# Altium schematic sheet Connectors.SchDoc
size A3; SheetNumber: 3; SheetTotal: 9
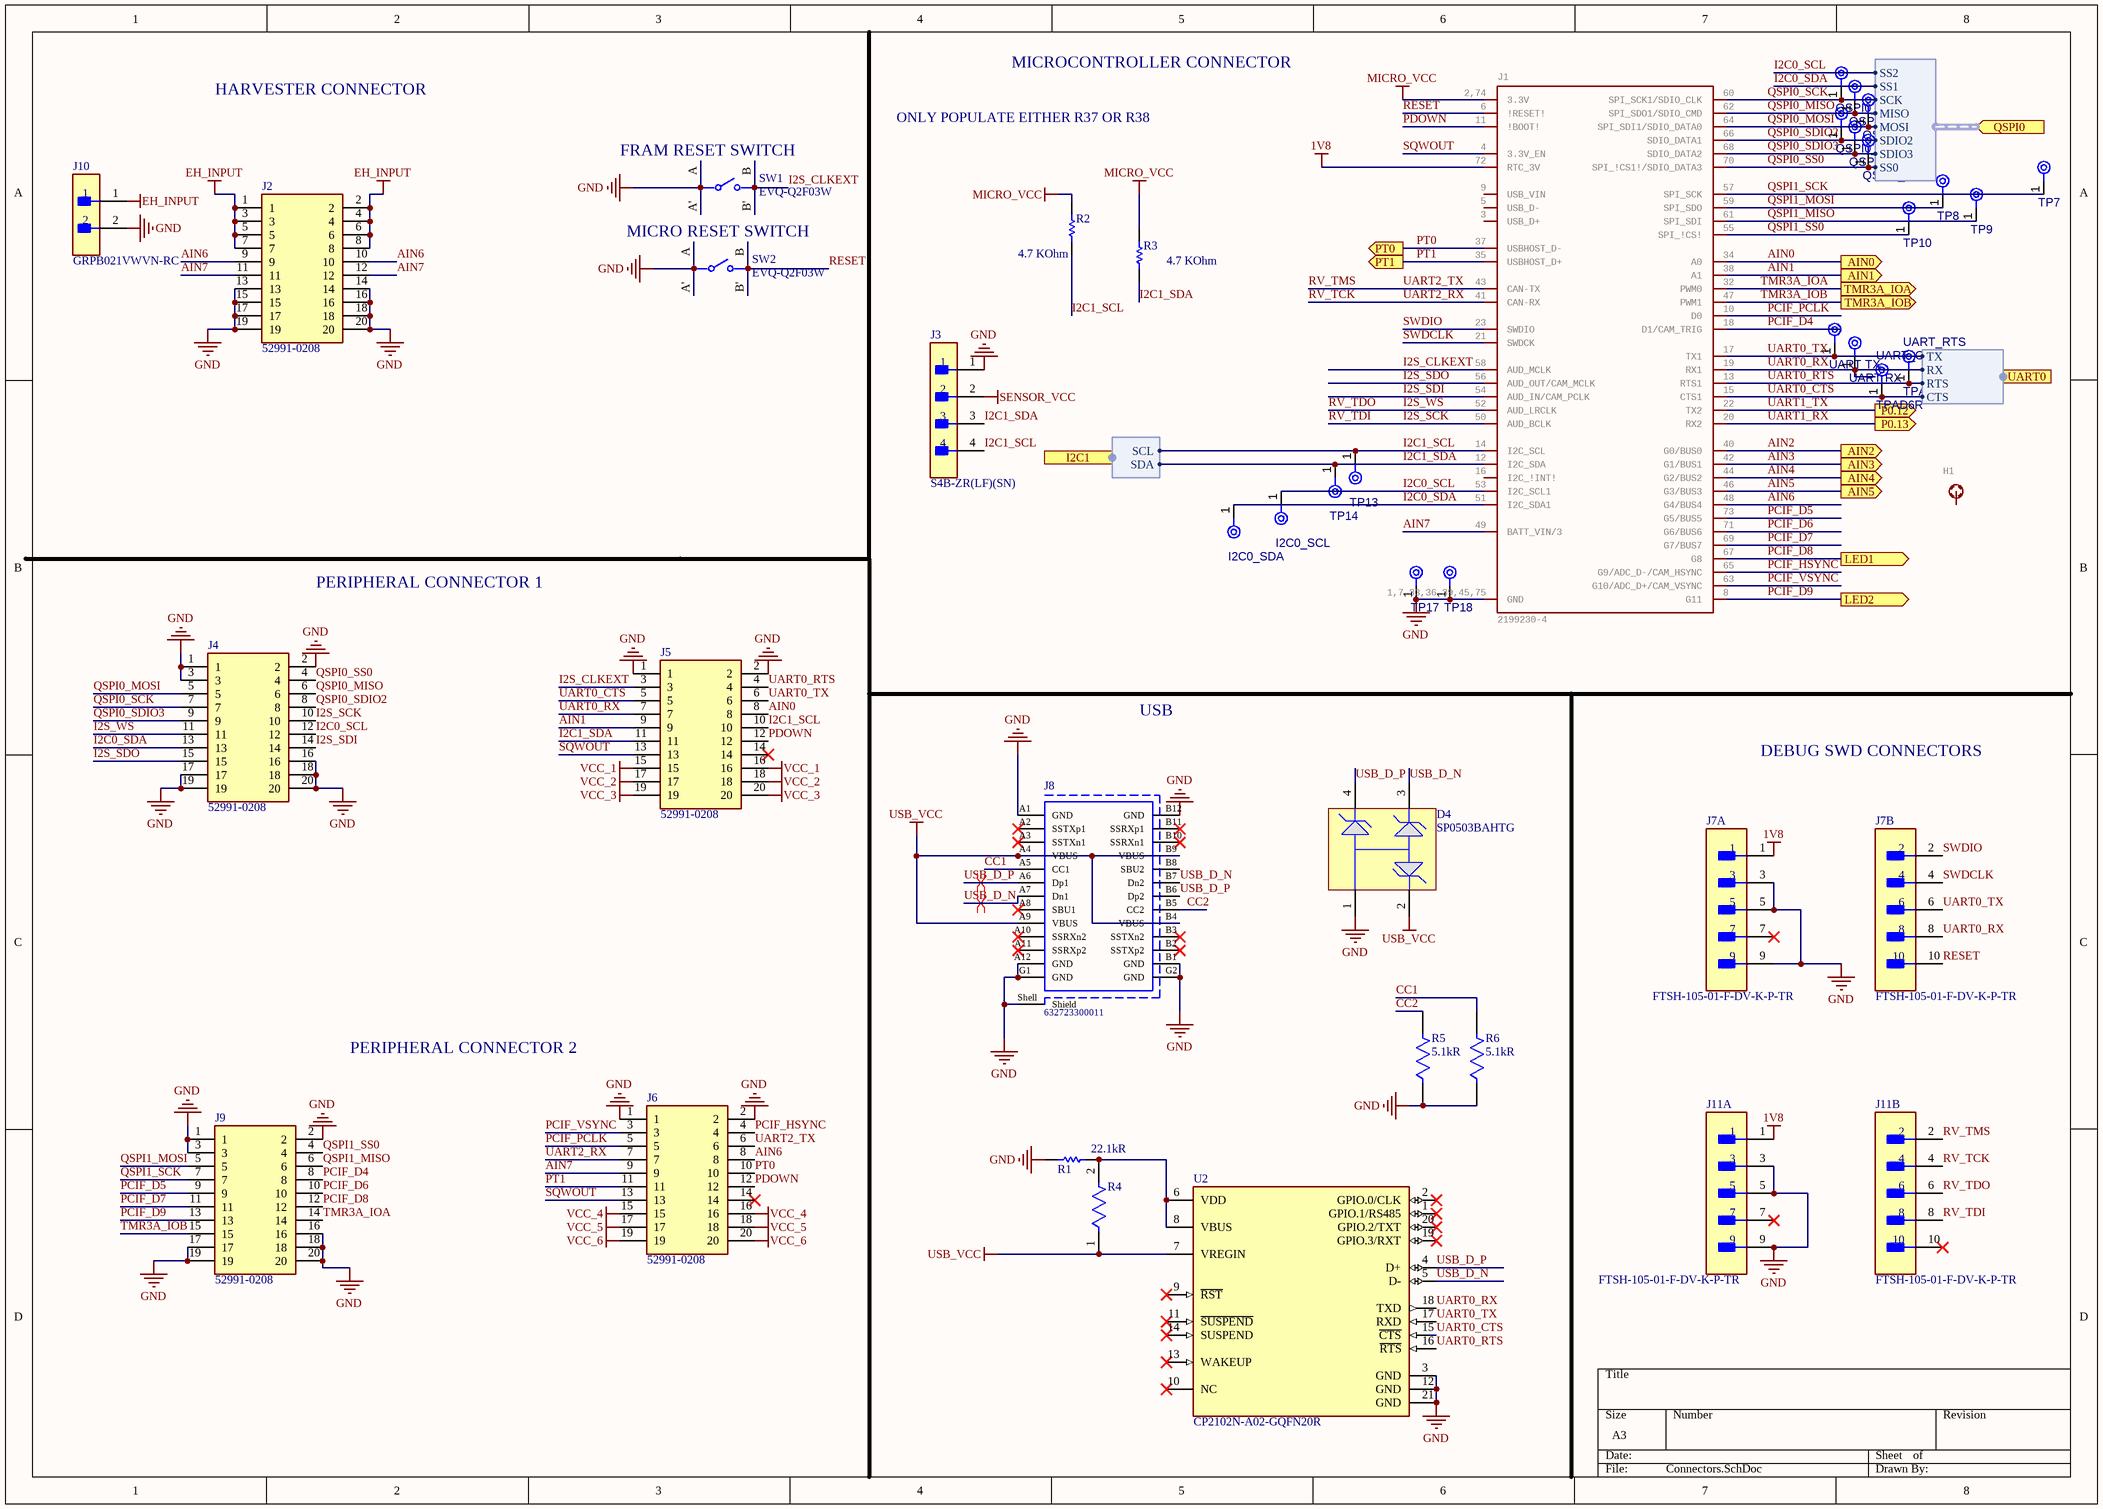
[diagram p0: Connectors.SchDoc]

## Parts
D4  SP0503BAHTG  [LFUS-SOT143-4_V]
H1  9774025151R  [STAND-OFF-REFLOW-M2-5]  (value not drawn)
I2C0_SCL  TPAD6R  [TP06R]  (value not drawn)  (no BOM)
I2C0_SDA  TPAD6R  [TP06R]  (value not drawn)  (no BOM)
J1  2199230-4  [M-2-CONNECTOR-E]
J2  52991-0208  [MOLEX_52991-0208]
J3  S4B-ZR(LF)(SN)  [FP-S4B-ZR_LF_SN-MFG]
J4  52991-0208  [MOLEX_52991-0208]
J5  52991-0208  [MOLEX_52991-0208]
J6  52991-0208  [MOLEX_52991-0208]
J7  FTSH-105-01-F-DV-K-P-TR  [FP-FTSH-105-01-F-DV-K-P-T-MFG]  (parts A,B of 2)
J8  632723300011  [632723300011]
J9  52991-0208  [MOLEX_52991-0208]
J10  GRPB021VWVN-RC  [FP-GRPB021VWVN-RC-MFG]
J11  FTSH-105-01-F-DV-K-P-TR  [FP-FTSH-105-01-F-DV-K-P-T-MFG]  (parts A,B of 2)
QSPI0_MISO  TPAD6R  [TP06R]  (value not drawn)  (no BOM)
QSPI0_MOSI  TPAD6R  [TP06R]  (value not drawn)  (no BOM)
QSPI0_SCK  TPAD6R  [TP06R]  (value not drawn)  (no BOM)
QSPI0_SDIO2  TPAD6R  [TP06R]  (value not drawn)  (no BOM)
QSPI0_SDIO3  TPAD6R  [TP06R]  (value not drawn)  (no BOM)
QSPI0_SS0  TPAD6R  [TP06R]  (value not drawn)  (no BOM)
R1  CRCW040247K5FKED  [RESC1005X40X25ML05T05]  (value not drawn)
R2  Resistance: 4.7 KOhm  [RESC1005X40X25ML05T05]  (hidden comment: RMCF0402JT4K70)
R3  Resistance: 4.7 KOhm  [RESC1005X40X25ML05T05]  (hidden comment: RMCF0402JT4K70)
R4  Resistance: 22.1kR  [FP-ERJ2RK-IPC_C]  (hidden comment: ERJ-2RKF2212X)
R5  Resistance: 5.1kR  [FP-CRCW0402-e3-IPC_A]  (hidden comment: CRCW04025K10FKED)
R6  Resistance: 5.1kR  [FP-CRCW0402-e3-IPC_A]  (hidden comment: CRCW04025K10FKED)
SW1  EVQ-Q2F03W  [FP-EVQ-Q2F03W-MFG]
SW2  EVQ-Q2F03W  [FP-EVQ-Q2F03W-MFG]
TP7  TPAD6R  [TP06R]  (value not drawn)  (no BOM)
TP8  TPAD6R  [TP06R]  (value not drawn)  (no BOM)
TP9  TPAD6R  [TP06R]  (value not drawn)  (no BOM)
TP10  TPAD6R  [TP06R]  (value not drawn)  (no BOM)
TP13  TPAD6R  [TP06R]  (value not drawn)  (no BOM)
TP14  TPAD6R  [TP06R]  (value not drawn)  (no BOM)
TP17  TPAD6R  [TP06R]  (value not drawn)  (no BOM)
TP18  TPAD6R  [TP06R]  (value not drawn)  (no BOM)
U2  CP2102N-A02-GQFN20R  [FP-CP2102N-A02-GQFN20R-MFG]
UART_CTS  TPAD6R  [TP06R]  (no BOM)
UART_RTS  TPAD6R  [TP06R]  (no BOM)
UART_RX  TPAD6R  [TP06R]  (value not drawn)  (no BOM)
UART_TX  TPAD6R  [TP06R]  (value not drawn)  (no BOM)

## Ports
AIN0 (out), AIN1 (out), AIN2 (out), AIN3 (out), AIN4 (out), AIN5 (out), I2C1 (in, harness I2C1), LED1 (out), LED2 (out), P0.12 (out), P0.13 (out), PT0 (out), PT1 (out), QSPI0 (in, harness QSPI0), TMR3A_IOA (out), TMR3A_IOB (out), UART0 (out, harness *)

## Harnesses
QSPI0: SCK, MISO, MOSI, SDIO2, SDIO3, SS0, SS1, SS2
I2C1: SCL, SDA
*: TX, RX, RTS, CTS

## Nets
1V8: J1.72(RTC_3V) J7.1 J11.1
EH_INPUT: J2.1 J2.2 J2.3 J2.4 J2.5 J2.6 J2.7 J2.8 J10.1
GND: D4.1 J1.1,7,33,36,39,45,75(GND) J2.13 J2.14 J2.15 J2.16 J2.17 J2.18 J2.19 J2.20 J3.1 J4.1 J4.2 J4.3 J4.16 J4.17 J4.18 J4.19 J4.20 J5.1 J5.2 J6.1 J6.2 J7.3 J7.5 J7.9 J8.A1(GND) J8.A12(GND) J8.B1(GND) J8.B12(GND) J8.G1(GND) J8.G2(GND) J8.Shell(Shield) J9.1 J9.2 J9.3 J9.16 J9.17 J9.18 J9.19 J9.20 J10.2 J11.3 J11.5 J11.9 R1.1 R5.1 R6.1 SW1.A SW1.A' SW2.A SW2.A' TP17.1(TP) TP18.1(TP) U2.3(GND) U2.12(GND) U2.21(GND)
MICRO_VCC: J1.2,74(3.3V) R2.2 R3.2
SENSOR_VCC: J3.2
USB_VCC: D4.2 J8.A4(VBUS) J8.A9(VBUS) J8.B4(VBUS) J8.B9(VBUS) R4.1 U2.7(VREGIN)
VCC_1: J5.15 J5.16
VCC_2: J5.17 J5.18
VCC_3: J5.19 J5.20
VCC_4: J6.15 J6.16
VCC_5: J6.17 J6.18
VCC_6: J6.19 J6.20
AIN0: J1.34(A0) J5.8 ; port AIN0
AIN1: J1.38(A1) J5.9 ; port AIN1
AIN2: J1.40(G0/BUS0) ; port AIN2
AIN3: J1.42(G1/BUS1) ; port AIN3
AIN4: J1.44(G2/BUS2) ; port AIN4
AIN5: J1.46(G3/BUS3) ; port AIN5
AIN6: J1.48(G4/BUS4) J2.9 J2.10 J6.8
AIN7: J1.49(BATT_VIN/3) J2.11 J2.12 J6.9
CC1: J8.A5(CC1) R6.2
CC2: J8.B5(CC2) R5.2
I2C0_SCL: I2C0_SCL.1(TP) J1.53(I2C_SCL1) J4.12 ; port QSPI0.SS2
I2C0_SDA: I2C0_SDA.1(TP) J1.51(I2C_SDA1) J4.13 ; port QSPI0.SS1
I2C1_SCL: J1.14(I2C_SCL) J3.4 J5.10 R2.1 TP13.1(TP) ; port I2C1.SCL
I2C1_SDA: J1.12(I2C_SDA) J3.3 J5.11 R3.1 TP14.1(TP) ; port I2C1.SDA
I2S_CLKEXT: J1.58(AUD_MCLK) J5.3 SW1.B SW1.B'
I2S_SCK: J1.50(AUD_BCLK) J4.10 J11.8  [also labelled RV_TDI]
I2S_SDI: J1.54(AUD_IN/CAM_PCLK) J4.14
I2S_SDO: J1.56(AUD_OUT/CAM_MCLK) J4.15
I2S_WS: J1.52(AUD_LRCLK) J4.11 J11.6  [also labelled RV_TDO]
PCIF_D4: J1.18(D1/CAM_TRIG) J9.8
PCIF_D5: J1.73(G5/BUS5) J9.9
PCIF_D6: J1.71(G6/BUS6) J9.10
PCIF_D7: J1.69(G7/BUS7) J9.11
PCIF_D8: J1.67(G8) J9.12 ; port LED1
PCIF_D9: J1.8(G11) J9.13 ; port LED2
PCIF_HSYNC: J1.65(G9/ADC_D-/CAM_HSYNC) J6.4
PCIF_PCLK: J1.10(D0) J6.5
PCIF_VSYNC: J1.63(G10/ADC_D+/CAM_VSYNC) J6.3
PDOWN: J1.11(!BOOT!) J5.12 J6.12
PT0: J1.37(USBHOST_D-) J6.10 ; port PT0
PT1: J1.35(USBHOST_D+) J6.11 ; port PT1
QSPI0_MISO: J1.62(SPI_SDO1/SDIO_CMD) J4.6 QSPI0_MISO.1(TP) ; port QSPI0.MISO
QSPI0_MOSI: J1.64(SPI_SDI1/SDIO_DATA0) J4.5 QSPI0_MOSI.1(TP) ; port QSPI0.MOSI
QSPI0_SCK: J1.60(SPI_SCK1/SDIO_CLK) J4.7 QSPI0_SCK.1(TP) ; port QSPI0.SCK
QSPI0_SDIO2: J1.66(SDIO_DATA1) J4.8 QSPI0_SDIO2.1(TP) ; port QSPI0.SDIO2
QSPI0_SDIO3: J1.68(SDIO_DATA2) J4.9 QSPI0_SDIO3.1(TP) ; port QSPI0.SDIO3
QSPI0_SS0: J1.70(SPI_!CS1!/SDIO_DATA3) J4.4 QSPI0_SS0.1(TP) ; port QSPI0.SS0
QSPI1_MISO: J1.61(SPI_SDI) J9.6 TP9.1(TP)
QSPI1_MOSI: J1.59(SPI_SDO) J9.5 TP8.1(TP)
QSPI1_SCK: J1.57(SPI_SCK) J9.7 TP7.1(TP)
QSPI1_SS0: J1.55(SPI_!CS!) J9.4 TP10.1(TP)
RESET: J1.6(!RESET!) J7.10 SW2.B SW2.B'
RV_TCK: J1.41(CAN-RX) J6.7 J11.4  [also labelled UART2_RX]
RV_TMS: J1.43(CAN-TX) J6.6 J11.2  [also labelled UART2_TX]
SQWOUT: J1.4(3.3V_EN) J5.13 J6.13
SWDCLK: J1.21(SWDCK) J7.4
SWDIO: J1.23(SWDIO) J7.2
TMR3A_IOA: J1.32(PWM0) J9.14 ; port TMR3A_IOA
TMR3A_IOB: J1.47(PWM1) J9.15 ; port TMR3A_IOB
UART0_CTS: J1.15(CTS1) J5.5 U2.15(~{CTS}) UART_CTS.1(TP) ; port UART0.CTS
UART0_RTS: J1.13(RTS1) J5.4 U2.16(~{RTS}) UART_RTS.1(TP) ; port UART0.RTS
UART0_RX: J1.19(RX1) J5.7 J7.8 U2.18(TXD) UART_RX.1(TP) ; port UART0.RX
UART0_TX: J1.17(TX1) J5.6 J7.6 U2.17(RXD) UART_TX.1(TP) ; port UART0.TX
UART1_RX: J1.20(RX2) ; port P0.13
UART1_TX: J1.22(TX2) ; port P0.12
USB_D_N: D4.3 J8.A7(Dn1) J8.B7(Dn2) U2.5(D-)
USB_D_P: D4.4 J8.A6(Dp1) J8.B6(Dp2) U2.4(D+)
NetR1_2: R1.2 R4.2 U2.6(VDD) U2.8(VBUS)

Not connected (* = marked no-connect by the designer): H1 1; J1 3(USB_D+) 5(USB_D-) 9(USB_VIN) 16(I2C_!INT!); J5 14*; J6 14*; J7 7*; J8 A2(SSTXp1)* A3(SSTXn1)* A8(SBU1)* A10(SSRXn2)* A11(SSRXp2)* B2(SSTXp2)* B3(SSTXn2)* B8(SBU2) B10(SSRXn1)* B11(SSRXp1)*; J11 7* 10*; U2 1(GPIO.1/RS485)* 2(GPIO.0/CLK)* 9(~{RST})* 10(NC)* 11(~{SUSPEND})* 13(WAKEUP)* 14(SUSPEND)* 19(GPIO.3/RXT)* 20(GPIO.2/TXT)*

## Layout directives
differential pair: USB_D_N, USB_D_P

## Notes on the sheet
- HARVESTER CONNECTOR
- MICROCONTROLLER CONNECTOR
- (near SW1) FRAM RESET SWITCH
- ONLY POPULATE EITHER R37 OR R38
- MICRO RESET SWITCH
- PERIPHERAL CONNECTOR 1
- USB
- DEBUG SWD CONNECTORS
- PERIPHERAL CONNECTOR 2

## Library data of the parts
D4 = CMP-2000-05191-1: TVS Diode Array, 30 pF, 30 KV, -40 to 85 degC, 4-Pin SOT143, RoHS, Tape and Reel; Manufacturer: Littelfuse; Direction Type: Uni-Directional; Product Height (mm): 1.05mm; Leakage Current (Max): 0.1uA; Clamping Voltage (Max): 8V; Reverse Stand-off Voltage: 5.5(Min)V; Configuration: Triple; Working Voltage: 5.5V; Product Length (mm): 3.04mm; Working Voltage (Max): 5.5V(Min); Capacitance Value: 30pF; Rad Hardened: No; Number of Elements: 3; Product Depth (mm): 1.4mm; Operating Temperature Max Deg. C: 85C; Suppressor Type: TVS; Operating Temperature Min Deg. C: -40C; Operating Temp Range: -40Cto85C; Mounting: SurfaceMount; Package / Case: SOT-143; Datasheet Version: Dec-13; Package Type: SOT-143; Packaging: TapeandReel; Pin Count: 3+Tab; Operating Temperature Classification: Industrial; Datasheet URL: https://datasheet.ciiva.com/15143/getdatasheetpartid-116020-15143550.pdf; Manufacturer URL: http://www.littelfuse.com/; Leakage Current: 0.1uA; Mounting Style: SurfaceMount; Clamping Voltage: 8V; Polarity: Uni-Directional
H1 = STAND-OFF-REFLOW2.5MM_TALL: GateName_1: G$1; PROD_ID: HW-14899; SymbolName_1: STAND-OFF-REFLOW; DeviceName: 2.5MM_TALL; LibraryName: SparkFun-Hardware; DeviceSetName: STAND-OFF-REFLOW; Package: STAND-OFF-REFLOW-M2.5
I2C0_SCL I2C0_SDA QSPI0_MISO QSPI0_MOSI QSPI0_SCK QSPI0_SDIO2 QSPI0_SDIO3 QSPI0_SS0 TP7-TP10 TP13 TP14 TP17 TP18 UART_CTS UART_RTS UART_RX UART_TX = CMP-00028-00002-2: 0.6mm round; Pins: 1
J1 = MICROMOD-2222-C: GateName_1: J1; PROD_ID: CONN-14877; SymbolName_1: MICROMOD; DeviceName: -2222-C; LibraryName: SparkFun-MicroMod; DeviceSetName: MICROMOD; Package: M.2-CONNECTOR-E
J2 J4-J6 J9 = 52991-0208: 20 Position Connector Receptacle, Center Strip Contacts Surface Mount Gold; MF: Molex; SnapEDA_Link: https://www.snapeda.com/parts/52991-0208/Molex/view-part/230631/?ref=snap; Availability: Unavailable; MP: 52991-0208; Price: None; Package: None; Value: *
J3 = CMP-17439-000004-1: CONN HEADER R/A 4POS 1.5MM; Manufacturer: JST; Conn Gender: Male; Conn Orientation: Right Angle; Number Of Contacts: 4; Voltage Rating: 50V; Current Rating: 1A; Device Class L3: unset; Number Of Rows: 1; Category: Conn; ComponentLink2URL: http://www.jst-mfg.com/product/pdf/eng/eZH.pdf; Height: 3.7mm; Pitch: 1.5mm; Device Class L1: Connectors; Octopart: https://octopart.com/s4b-zr%28lf%29%28sn%29-jst-248835; Package: S4B-ZR(LF)(SN); Temperature: -25°C to +85°C; Digikey Description: CONN HEADER R/A 4POS 1.5MM; Contact Material: Tin; Manufacturer Part Number: S4B-ZR(LF)(SN); Temperature Range High: +85°C; Automotive: No; Temperature Range Low: -25°C; Lead Free: Yes; RoHS: TRUE; ComponentLink2Description: Datasheet; Device Class L2: Headers and Wire Housings
J7 J11 = CMP-02766-000120-1: CONN HEADER SMD 10POS 1.27MM; Number of Contacts: 10; Row Spacing: 0.05inch; Connector Type: Male Pin; Contact Plating: Gold; Housing Material: Polymer; Length: 6.35mm; Number of Rows: 2; Min Operating Temperature: -55°C; Pitch: 1.27mm; Termination: Solder; Package Quantity: 500; Lead Free: Lead Free; Radiation Hardening: No; Number of Positions: 10; Orientation: Straight; Contact Material: Bronze; Packaging: Tape and Reel; Depth: 5.84mm; Contact Mating Length: 0.12inch; Housing Color: Black; Mount: Surface Mount; Color: Black; Max Operating Temperature: 125°C
J8 = CMP-1502-03214-1: USB 3.1 Type C Receptacle WR-COM, Horizontal, SMT / THT; Manufacturer: Wurth Elektronik; Rated Current: 5A; Contact Resistance: 30mOhm; Working Voltage: 20VDC; Operating Temperature: -40to105degC; Package Reference: 632723300011; Datasheet URL: https://katalog.we-online.de/em/datasheet/632723x00011%282%29.pdf; Manufacturer URL: http://www.we-online.de; Connector Type: USB3.1TypeC; Gender: Receptacle; Part Number: 632723300011; Mounting Technology: SMT/THT; Publisher: WurthElektronik; Packaging: TapeandReel; Orientation: Horizontal
J10 = CMP-2000-06371-2: CONN HEADER VERT 2POS 1.27MM; Number of Positions: 2; Connector Type: Male Pin; Pitch: 0.05inch; Contact Plating: Gold; Lead Free: Lead Free; Termination: Solder; Packaging: Bulk; RoHS Compliant: Yes; Contact Type: Male Pin; Mount: Through Hole; Number of Rows: 1; Contact Mating Length: 0.118inch; Package Quantity: 1
R1 = CMP-2002-00027-1: Manufacturer: Vishay Dale; Part Number: CRCW040247K5FKED
R2 R3 = CMP-2002-01154-4: Chip Resistor, 4.7 KOhm, +/- 1%, 0.1 W, -55 to 155 degC, 0402 (1005 Metric), RoHS, Tape and Reel; PartNumber: ERJ-2RKF4701X; Voltage Rating: 50 V; Case\/Package: 0402; Power Rating: 100 mW; Height: 0.35 mm; Mounting Technology: Surface Mount; REACH SVHC: Yes; Max Operating Temperature: 155 degC; ComponentLink1Description: Manufacturer URL; ComponentLink2Description: Datasheet; Pins: 2; PackageReference: 0402; Tolerance: 1%; Case Code (Imperial): 0402; Length: 1 mm; PackageDescription: 2-Pin Surface Mount Device, Body 1 x 0.5 mm; RoHSCompliant: true; Package Quantity: 1; Radiation Hardening: No; DatasheetVersion: 04/2015; Width: 0.5 mm; Case Code (Metric): 1005; Mount: Surface Mount; ComponentLink1URL: http://www.panasonic.com/; Min Operating Temperature: -55 degC; Packaging: Cut Tape; ComponentLink2URL: http://industrial.panasonic.com/cdbs/www-data/pdf/RDA0000/AOA0000C86.pdf
R4 = CMP-1011-00660-3: RES SMD 22.1K OHM 1% 1/10W 0402; Max Power Dissipation: 100mW; Temperature Coefficient: 100ppm/°C; Voltage Rating (DC): 50V; Features: Automotive AEC-Q200; Case Code (Imperial): 0402; Mount: Surface Mount; Min Operating Temperature: -55°C; Package Quantity: 1; Radiation Hardening: No; Case/Package: 0402; Max Operating Temperature: 155°C; Tolerance: 1%; Series: ERJ; Size Code: 0402; RoHS Compliant: Yes; Packaging: Tape and Reel; Contact Plating: Tin; Depth: 0.5mm; Lead Free: Lead Free; REACH SVHC: No SVHC; Length: 1mm; Height: 0.35mm; Number of Terminations: 2; Technology: THICK FILM; Termination: SMD/SMT; Case Code (Metric): 1005; Construction: Rectangular; Width: 0.02inch; Power Rating: 100mW; Voltage Rating: 50V; Military Standard: Not; Resistor Type: Thick Film; Resistance Tolerance: 1%
R5 R6 = CMP-1011-00590-4: RES Thick Film, 5.1kΩ, 1%, 0.063W, 100ppm/°C, 0402; Voltage Rating: 50V; Max Power Dissipation: 63mW; Case/Package: 0402; Min Operating Temperature: -55°C; Height: 0.35mm; Contact Plating: Tin; Tolerance: 1%; Max Operating Temperature: 155°C; Lead Free: Lead Free; Number of Terminations: 2; Temperature Coefficient: 100ppm/°C; Weight: 2.3E-05oz; Termination: SMD/SMT; Radiation Hardening: No; Voltage Rating (DC): 50V; Length: 1mm; Features: Automotive AEC-Q200; Case Code (Metric): 1005; Width: 0.02inch; Package Quantity: 10; Military Standard: Not; Depth: 0.5mm; Packaging: Tape and Reel; Power Rating: 63mW; Case Code (Imperial): 0402; Composition: Thick Film
SW1 SW2 = CMP-05618-000127-1: SWITCH TACTILE SPST-NO 0.02A 15V; Body Depth: 6mm; Illumination Type: Non-Illuminated; Mechanical Life: 1000000Cycles; Switch Travel: 0.2mm; Actuator Length: 1.3mm; Max Voltage Rating (AC): 250V; Contact Resistance: 100mR; Operating Force: 1N; Current Rating: 20mA; Switch Function: Off-Mom; Actuator Color: White; Number of Poles: 1; Throw Configuration: SPST; Actuator Type: Standard; Contact Plating: Gold; Lead Free: Lead Free; Package Quantity: 1; Radiation Hardening: No; Depth: 6.6mm; Termination: SMD/SMT; Voltage Rating (AC): 250V; Size: 1.8mm; Thickness: 1.8mm; Height: 3.1mm; Mount: Surface Mount; Contact Current Rating: 20mA; Color: White; Width: 6.5mm; Series: EVQQ2; Max Operating Temperature: 85°C; Min Operating Temperature: -40°C; Packaging: Tape and Reel; Voltage Rating (DC): 15V; RoHS Compliant: Yes; Length: 6mm; Max Voltage Rating (DC): 15V; Max Current Rating: 20mA; Case/Package: SMD/SMT; Orientation: Straight; Electrical Life: 1000000Cycles
U2 = CMP-08107-000007-1: IC USB TO UART BRIDGE QFN20